# EAGLE schematic pulldown (EAGLE 8.3.1)
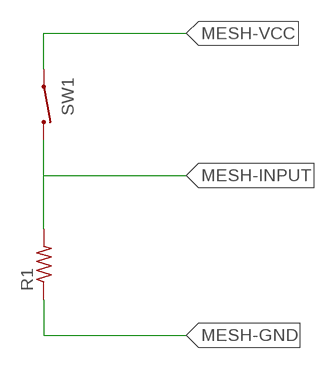
[diagram p0: schematic, sheet 1]

## Parts
R1  R-US_0204/2V  [0204V]
SW1  TVBP06  [TVBP06]

## Nets
MESH-GND: R1.1
MESH-INPUT: R1.2 SW1.2
MESH-VCC: SW1.1

## Library data of the parts
R1 = rcl:R-US_: RESISTOR, American symbol
SW1 = switches:TVBP06: 2pin switch. http://akizukidenshi.com/catalog/g/gP-08074/